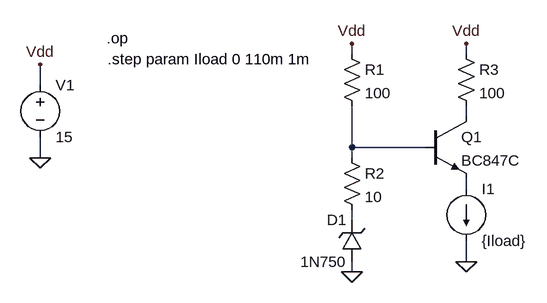
[diagram p0: schematic bjt-supply-25mA.asc]
bjt-supply-25mA.asc, the LTspice schematic file:
Version 4
SHEET 1 880 680
WIRE -432 -208 -432 -224
WIRE -256 -208 -256 -224
WIRE -912 -160 -912 -192
WIRE -256 -112 -256 -128
WIRE -432 -64 -432 -128
WIRE -320 -64 -432 -64
WIRE -912 -48 -912 -80
WIRE -432 -48 -432 -64
WIRE -256 0 -256 -16
WIRE -432 48 -432 32
WIRE -256 112 -256 80
WIRE -432 128 -432 112
FLAG -912 -48 0
FLAG -912 -192 Vdd
FLAG -256 -224 Vdd
FLAG -256 112 0
FLAG -432 -224 Vdd
FLAG -432 128 0
SYMBOL voltage -912 -176 R0
WINDOW 123 0 0 Left 2
WINDOW 39 0 0 Left 2
SYMATTR InstName V1
SYMATTR Value 15
SYMBOL npn -320 -112 R0
SYMATTR InstName Q1
SYMATTR Value BC847C
SYMBOL res -272 -224 R0
SYMATTR InstName R3
SYMATTR Value 100
SYMBOL current -256 0 R0
WINDOW 123 0 0 Left 2
WINDOW 39 0 0 Left 2
SYMATTR InstName I1
SYMATTR Value {Iload}
SYMBOL res -448 -224 R0
SYMATTR InstName R1
SYMATTR Value 100
SYMBOL res -448 -64 R0
SYMATTR InstName R2
SYMATTR Value 10
SYMBOL zener -416 112 R180
WINDOW 0 24 64 Left 2
WINDOW 3 24 0 Left 2
SYMATTR InstName D1
SYMATTR Value 1N750
TEXT -810 -232 Left 2 !.op
TEXT -808 -200 Left 2 !.step param Iload 0 110m 1m

The netlist it stands for:
* bjt-supply-25mA.asc
V1 Vdd 0 15
Q1 N001 N002 N003 0 BC847C
R3 Vdd N001 100
I1 N003 0 {Iload}
R1 Vdd N002 100
R2 N002 N004 10
D1 0 N004 1N750
.model D D
.lib standard.dio
.model NPN NPN
.model PNP PNP
.lib standard.bjt
.op
.step param Iload 0 110m 1m
.backanno
.end